# EAGLE schematic LEDDriverBoardV1_0 (EAGLE 7.4.0)
Quad Boost Converter (LT3757-based)
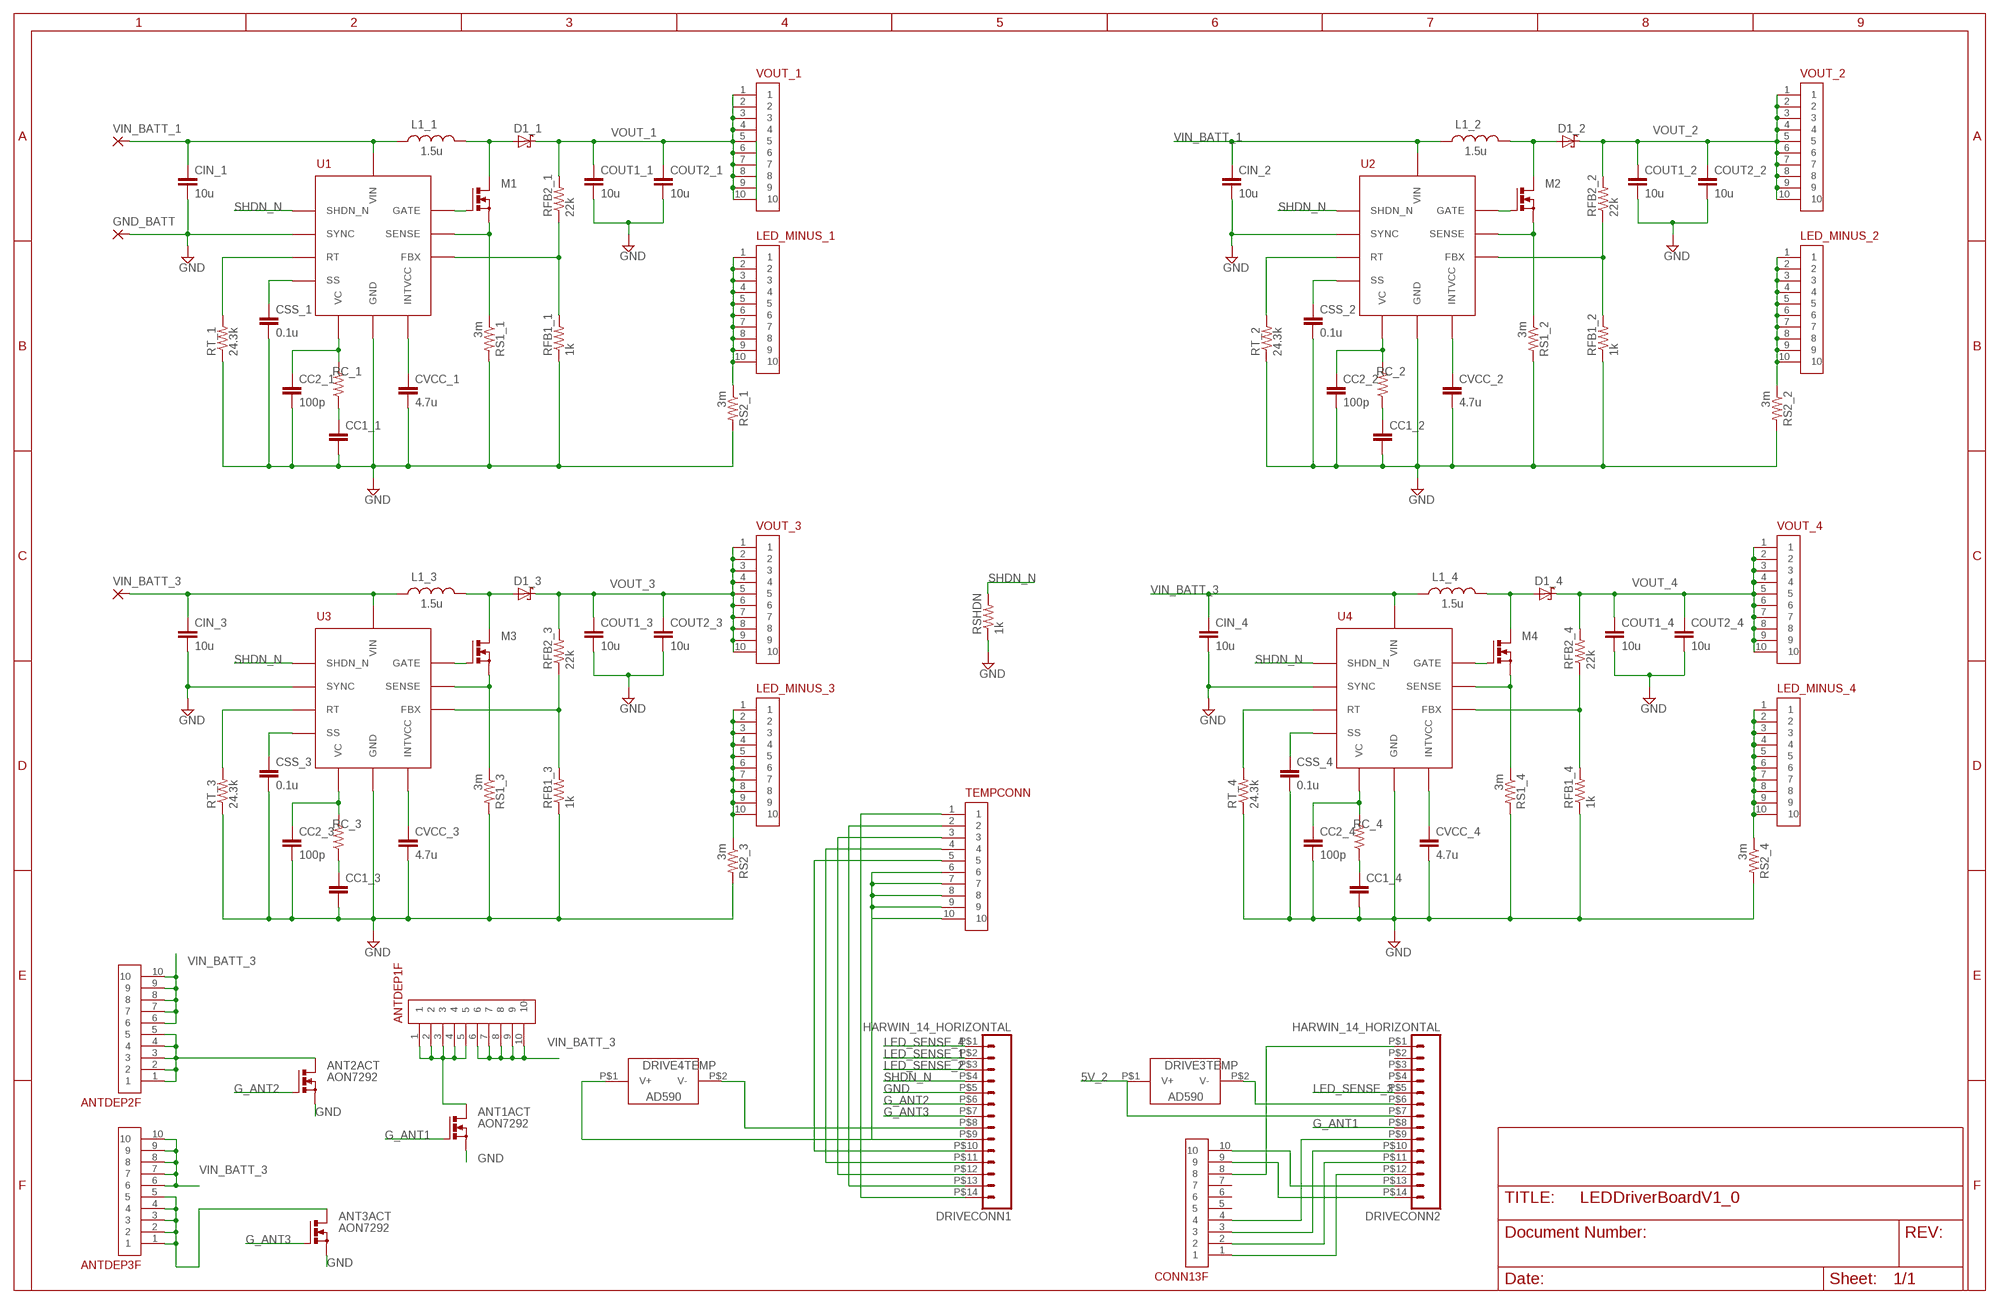
[diagram p0: schematic, sheet 1]

## Parts
ANT1ACT  AON7292  [DFN3.3X3.3]
ANT2ACT  AON7292  [DFN3.3X3.3]
ANT3ACT  AON7292  [DFN3.3X3.3]
ANTDEP1F  M50-3120545  [10PINFEMALE]
ANTDEP2F  M50-3120545  [10PINFEMALE]
ANTDEP3F  M50-3120545  [10PINFEMALE]
CC1_1  C-EUC0603  [C0603]
CC1_2  C-EUC0603  [C0603]
CC1_3  C-EUC0603  [C0603]
CC1_4  C-EUC0603  [C0603]
CC2_1  100p  C-EUC0603  [C0603]
CC2_2  100p  C-EUC0603  [C0603]
CC2_3  100p  C-EUC0603  [C0603]
CC2_4  100p  C-EUC0603  [C0603]
CIN_1  10u  C-EUC1210  [C1210]
CIN_2  10u  C-EUC1210  [C1210]
CIN_3  10u  C-EUC1210  [C1210]
CIN_4  10u  C-EUC1210  [C1210]
CONN13F  M50-3120545  [10PINFEMALE]
COUT1_1  10u  C-EUC1210  [C1210]
COUT1_2  10u  C-EUC1210  [C1210]
COUT1_3  10u  C-EUC1210  [C1210]
COUT1_4  10u  C-EUC1210  [C1210]
COUT2_1  10u  C-EUC1210  [C1210]
COUT2_2  10u  C-EUC1210  [C1210]
COUT2_3  10u  C-EUC1210  [C1210]
COUT2_4  10u  C-EUC1210  [C1210]
CSS_1  0.1u  C-EUC0603  [C0603]
CSS_2  0.1u  C-EUC0603  [C0603]
CSS_3  0.1u  C-EUC0603  [C0603]
CSS_4  0.1u  C-EUC0603  [C0603]
CVCC_1  4.7u  C-EUC0603  [C0603]
CVCC_2  4.7u  C-EUC0603  [C0603]
CVCC_3  4.7u  C-EUC0603  [C0603]
CVCC_4  4.7u  C-EUC0603  [C0603]
D1_1  CDBZ5T30100-HF  [SMC(Z5-T)]
D1_2  CDBZ5T30100-HF  [SMC(Z5-T)]
D1_3  CDBZ5T30100-HF  [SMC(Z5-T)]
D1_4  CDBZ5T30100-HF  [SMC(Z5-T)]
DRIVE3TEMP  AD590-TH  [AD590TH]
DRIVE4TEMP  AD590-TH  [AD590TH]
DRIVECONN1  HARWIN_14_HORIZONTAL  [HARWIN_DATAMATE_14_HORIZONTAL]
DRIVECONN2  HARWIN_14_HORIZONTAL  [HARWIN_DATAMATE_14_HORIZONTAL]
GND_BATT  3,81/1,4  [3,81/1,4]
L1_1  1.5u  SRP1245A-1R5M  [SRP1245A]
L1_2  1.5u  SRP1245A-1R5M  [SRP1245A]
L1_3  1.5u  SRP1245A-1R5M  [SRP1245A]
L1_4  1.5u  SRP1245A-1R5M  [SRP1245A]
LED_MINUS_1  M50-3120545  [10PINFEMALE]
LED_MINUS_2  M50-3120545  [10PINFEMALE]
LED_MINUS_3  M50-3120545  [10PINFEMALE]
LED_MINUS_4  M50-3120545  [10PINFEMALE]
M1  STL110N10F7  [POWERFLAT]
M2  STL110N10F7  [POWERFLAT]
M3  STL110N10F7  [POWERFLAT]
M4  STL110N10F7  [POWERFLAT]
RC_1  R-US_R0603  [R0603]
RC_2  R-US_R0603  [R0603]
RC_3  R-US_R0603  [R0603]
RC_4  R-US_R0603  [R0603]
RFB1_1  1k  R-US_R0603  [R0603]
RFB1_2  1k  R-US_R0603  [R0603]
RFB1_3  1k  R-US_R0603  [R0603]
RFB1_4  1k  R-US_R0603  [R0603]
RFB2_1  22k  R-US_R0603  [R0603]
RFB2_2  22k  R-US_R0603  [R0603]
RFB2_3  22k  R-US_R0603  [R0603]
RFB2_4  22k  R-US_R0603  [R0603]
RS1_1  3m  ERJMS4S  [ERJMS4S]
RS1_2  3m  ERJMS4S  [ERJMS4S]
RS1_3  3m  ERJMS4S  [ERJMS4S]
RS1_4  3m  ERJMS4S  [ERJMS4S]
RS2_1  3m  ERJMS4S  [ERJMS4S]
RS2_2  3m  ERJMS4S  [ERJMS4S]
RS2_3  3m  ERJMS4S  [ERJMS4S]
RS2_4  3m  ERJMS4S  [ERJMS4S]
RSHDN  1k  R-US_R0603  [R0603]
RT_1  24.3k  R-US_R0603  [R0603]
RT_2  24.3k  R-US_R0603  [R0603]
RT_3  24.3k  R-US_R0603  [R0603]
RT_4  24.3k  R-US_R0603  [R0603]
TEMPCONN  M50-3120545  [10PINFEMALE]
U1  LT3757  [MSOP10]
U2  LT3757  [MSOP10]
U3  LT3757  [MSOP10]
U4  LT3757  [MSOP10]
VIN_BATT_1  3,81/1,4  [3,81/1,4]
VIN_BATT_3  3,81/1,4  [3,81/1,4]
VOUT_1  M50-3120545  [10PINFEMALE]
VOUT_2  M50-3120545  [10PINFEMALE]
VOUT_3  M50-3120545  [10PINFEMALE]
VOUT_4  M50-3120545  [10PINFEMALE]

## Nets
5V_1: DRIVE4TEMP.P$1(V+) DRIVECONN1.P$9 TEMPCONN.6 TEMPCONN.7 TEMPCONN.8 TEMPCONN.9 TEMPCONN.10
5V_2: DRIVE3TEMP.P$1(V+) DRIVECONN2.P$7
FBX_1: RFB1_1.2 RFB2_1.1 U1.P$2(FBX)
FBX_2: RFB1_2.2 RFB2_2.1 U2.P$2(FBX)
FBX_3: RFB1_3.2 RFB2_3.1 U3.P$2(FBX)
FBX_4: RFB1_4.2 RFB2_4.1 U4.P$2(FBX)
FET_SENSE_1: M1.S1(S) M1.S2(S) M1.S3(S) RS1_1.A U1.P$6(SENSE)
FET_SENSE_2: M2.S1(S) M2.S2(S) M2.S3(S) RS1_2.A U2.P$6(SENSE)
FET_SENSE_3: M3.S1(S) M3.S2(S) M3.S3(S) RS1_3.A U3.P$6(SENSE)
FET_SENSE_4: M4.S1(S) M4.S2(S) M4.S3(S) RS1_4.A U4.P$6(SENSE)
G_ANT1: ANT1ACT.G DRIVECONN2.P$8
G_ANT2: ANT2ACT.G DRIVECONN1.P$6
G_ANT3: ANT3ACT.G DRIVECONN1.P$7
GATE_1: M1.G U1.P$7(GATE)
GATE_2: M2.G U2.P$7(GATE)
GATE_3: M3.G U3.P$7(GATE)
GATE_4: M4.G U4.P$7(GATE)
GND: ANT1ACT.S1(S) ANT1ACT.S2(S) ANT1ACT.S3(S) ANT2ACT.S1(S) ANT2ACT.S2(S) ANT2ACT.S3(S) ANT3ACT.S1(S) ANT3ACT.S2(S) ANT3ACT.S3(S) CC1_1.2 CC1_2.2 CC1_3.2 CC1_4.2 CC2_1.2 CC2_2.2 CC2_3.2 CC2_4.2 CIN_1.2 CIN_2.2 CIN_3.2 CIN_4.2 CONN13F.10 COUT1_1.2 COUT1_2.2 COUT1_3.2 COUT1_4.2 COUT2_1.2 COUT2_2.2 COUT2_3.2 COUT2_4.2 CSS_1.2 CSS_2.2 CSS_3.2 CSS_4.2 CVCC_1.2 CVCC_2.2 CVCC_3.2 CVCC_4.2 DRIVECONN1.P$5 DRIVECONN2.P$13 GND_BATT.1(P) RFB1_1.1 RFB1_2.1 RFB1_3.1 RFB1_4.1 RS1_1.B RS1_2.B RS1_3.B RS1_4.B RS2_1.B RS2_2.B RS2_3.B RS2_4.B RSHDN.1 RT_1.1 RT_2.1 RT_3.1 RT_4.1 U1.P$5(SYNC) U1.P$11(GND) U2.P$5(SYNC) U2.P$11(GND) U3.P$5(SYNC) U3.P$11(GND) U4.P$5(SYNC) U4.P$11(GND)
INTVCC_1: CVCC_1.1 U1.P$8(INTVCC)
INTVCC_2: CVCC_2.1 U2.P$8(INTVCC)
INTVCC_3: CVCC_3.1 U3.P$8(INTVCC)
INTVCC_4: CVCC_4.1 U4.P$8(INTVCC)
LDM_1: D1_1.ANODE L1_1.P$2 M1.D M1.D5(D) M1.D6(D) M1.D7(D) M1.D8(D)
LDM_2: D1_2.ANODE L1_2.P$2 M2.D M2.D5(D) M2.D6(D) M2.D7(D) M2.D8(D)
LDM_3: D1_3.ANODE L1_3.P$2 M3.D M3.D5(D) M3.D6(D) M3.D7(D) M3.D8(D)
LDM_4: D1_4.ANODE L1_4.P$2 M4.D M4.D5(D) M4.D6(D) M4.D7(D) M4.D8(D)
LED_SENSE_1: DRIVECONN1.P$2 LED_MINUS_1.1 LED_MINUS_1.2 LED_MINUS_1.3 LED_MINUS_1.4 LED_MINUS_1.5 LED_MINUS_1.6 LED_MINUS_1.7 LED_MINUS_1.8 LED_MINUS_1.9 LED_MINUS_1.10 RS2_1.A
LED_SENSE_2: DRIVECONN1.P$3 LED_MINUS_2.1 LED_MINUS_2.2 LED_MINUS_2.3 LED_MINUS_2.4 LED_MINUS_2.5 LED_MINUS_2.6 LED_MINUS_2.7 LED_MINUS_2.8 LED_MINUS_2.9 LED_MINUS_2.10 RS2_2.A
LED_SENSE_3: DRIVECONN2.P$5 LED_MINUS_3.1 LED_MINUS_3.2 LED_MINUS_3.3 LED_MINUS_3.4 LED_MINUS_3.5 LED_MINUS_3.6 LED_MINUS_3.7 LED_MINUS_3.8 LED_MINUS_3.9 LED_MINUS_3.10 RS2_3.A
LED_SENSE_4: DRIVECONN1.P$1 LED_MINUS_4.1 LED_MINUS_4.2 LED_MINUS_4.3 LED_MINUS_4.4 LED_MINUS_4.5 LED_MINUS_4.6 LED_MINUS_4.7 LED_MINUS_4.8 LED_MINUS_4.9 LED_MINUS_4.10 RS2_4.A
N$1: CC1_2.1 RC_2.1
N$2: CC1_3.1 RC_3.1
N$3: CC1_1.1 RC_1.1
N$4: CC1_4.1 RC_4.1
N$5: DRIVECONN1.P$11 TEMPCONN.4
N$6: DRIVECONN1.P$12 TEMPCONN.3
N$7: DRIVECONN1.P$13 TEMPCONN.2
N$8: DRIVECONN1.P$14 TEMPCONN.1
N$9: DRIVECONN1.P$10 TEMPCONN.5
N$10: DRIVE3TEMP.P$2(V-) DRIVECONN2.P$6
N$11: DRIVE4TEMP.P$2(V-) DRIVECONN1.P$8
N$12: CONN13F.4 DRIVECONN2.P$9
N$13: CONN13F.3 DRIVECONN2.P$10
N$14: CONN13F.2 DRIVECONN2.P$11
N$15: CONN13F.1 DRIVECONN2.P$12
N$17: CONN13F.9 DRIVECONN2.P$14
N$18: CONN13F.8 DRIVECONN2.P$1
N$20: ANT3ACT.D1(D) ANT3ACT.D2(D) ANT3ACT.D3(D) ANT3ACT.D4(D) ANT3ACT.D5(D) ANTDEP3F.1 ANTDEP3F.2 ANTDEP3F.3 ANTDEP3F.4 ANTDEP3F.5
N$21: ANT2ACT.D1(D) ANT2ACT.D2(D) ANT2ACT.D3(D) ANT2ACT.D4(D) ANT2ACT.D5(D) ANTDEP2F.1 ANTDEP2F.2 ANTDEP2F.3 ANTDEP2F.4 ANTDEP2F.5
N$22: ANT1ACT.D1(D) ANT1ACT.D2(D) ANT1ACT.D3(D) ANT1ACT.D4(D) ANT1ACT.D5(D) ANTDEP1F.1 ANTDEP1F.2 ANTDEP1F.3 ANTDEP1F.4 ANTDEP1F.5
RT_1: RT_1.2 U1.P$4(RT)
RT_2: RT_2.2 U2.P$4(RT)
RT_3: RT_3.2 U3.P$4(RT)
RT_4: RT_4.2 U4.P$4(RT)
SHDN_N: DRIVECONN1.P$4 RSHDN.2 U1.P$9(SHDN_N) U2.P$9(SHDN_N) U3.P$9(SHDN_N) U4.P$9(SHDN_N)
SS_1: CSS_1.1 U1.P$3(SS)
SS_2: CSS_2.1 U2.P$3(SS)
SS_3: CSS_3.1 U3.P$3(SS)
SS_4: CSS_4.1 U4.P$3(SS)
VC_1: CC2_1.1 RC_1.2 U1.P$1(VC)
VC_2: CC2_2.1 RC_2.2 U2.P$1(VC)
VC_3: CC2_3.1 RC_3.2 U3.P$1(VC)
VC_4: CC2_4.1 RC_4.2 U4.P$1(VC)
VIN_BATT_1: CIN_1.1 CIN_2.1 L1_1.P$1 L1_2.P$1 U1.P$10(VIN) U2.P$10(VIN) VIN_BATT_1.1(P)
VIN_BATT_3: ANTDEP1F.6 ANTDEP1F.7 ANTDEP1F.8 ANTDEP1F.9 ANTDEP1F.10 ANTDEP2F.6 ANTDEP2F.7 ANTDEP2F.8 ANTDEP2F.9 ANTDEP2F.10 ANTDEP3F.6 ANTDEP3F.7 ANTDEP3F.8 ANTDEP3F.9 ANTDEP3F.10 CIN_3.1 CIN_4.1 L1_3.P$1 L1_4.P$1 U3.P$10(VIN) U4.P$10(VIN) VIN_BATT_3.1(P)
VOUT_1: COUT1_1.1 COUT2_1.1 D1_1.CATHODE RFB2_1.2 VOUT_1.1 VOUT_1.2 VOUT_1.3 VOUT_1.4 VOUT_1.5 VOUT_1.6 VOUT_1.7 VOUT_1.8 VOUT_1.9 VOUT_1.10
VOUT_2: COUT1_2.1 COUT2_2.1 D1_2.CATHODE RFB2_2.2 VOUT_2.1 VOUT_2.2 VOUT_2.3 VOUT_2.4 VOUT_2.5 VOUT_2.6 VOUT_2.7 VOUT_2.8 VOUT_2.9 VOUT_2.10
VOUT_3: COUT1_3.1 COUT2_3.1 D1_3.CATHODE RFB2_3.2 VOUT_3.1 VOUT_3.2 VOUT_3.3 VOUT_3.4 VOUT_3.5 VOUT_3.6 VOUT_3.7 VOUT_3.8 VOUT_3.9 VOUT_3.10
VOUT_4: COUT1_4.1 COUT2_4.1 D1_4.CATHODE RFB2_4.2 VOUT_4.1 VOUT_4.2 VOUT_4.3 VOUT_4.4 VOUT_4.5 VOUT_4.6 VOUT_4.7 VOUT_4.8 VOUT_4.9 VOUT_4.10
Unconnected: CONN13F.5 CONN13F.6 CONN13F.7 DRIVECONN2.P$2 DRIVECONN2.P$3 DRIVECONN2.P$4

## Library data of the parts
ANT1ACT ANT2ACT ANT3ACT = LED_Driver_Board:AON7292
ANTDEP1F ANTDEP2F ANTDEP3F CONN13F LED_MINUS_1-LED_MINUS_4 TEMPCONN VOUT_1-VOUT_4 = LED_Driver_Board:M50-3120545
CC1_1-CC1_4 CC2_1-CC2_4 CIN_1-CIN_4 COUT1_1-COUT1_4 COUT2_1-COUT2_4 CSS_1-CSS_4 CVCC_1-CVCC_4 = rcl:C-EU: CAPACITOR, European symbol
D1_1-D1_4 = Cubesat:CDBZ5T30100-HF
DRIVE3TEMP DRIVE4TEMP = CNTRL_BOARD:AD590-TH
DRIVECONN1 DRIVECONN2 = CNTRL_BOARD:HARWIN_14_HORIZONTAL
GND_BATT VIN_BATT_1 VIN_BATT_3 = wirepad:3,81/1,4: THROUGH-HOLE PAD
L1_1-L1_4 = Cubesat:SRP1245A-1R5M
M1-M4 = LED_Driver_Board:STL110N10F7
RC_1-RC_4 RFB1_1-RFB1_4 RFB2_1-RFB2_4 RSHDN RT_1-RT_4 = resistor:R-US_: RESISTOR, American symbol
RS1_1-RS1_4 RS2_1-RS2_4 = Cubesat:ERJMS4S
U1-U4 = LED_Driver_Board:LT3757